# Altium schematic sheet mode.SchDoc
size A3
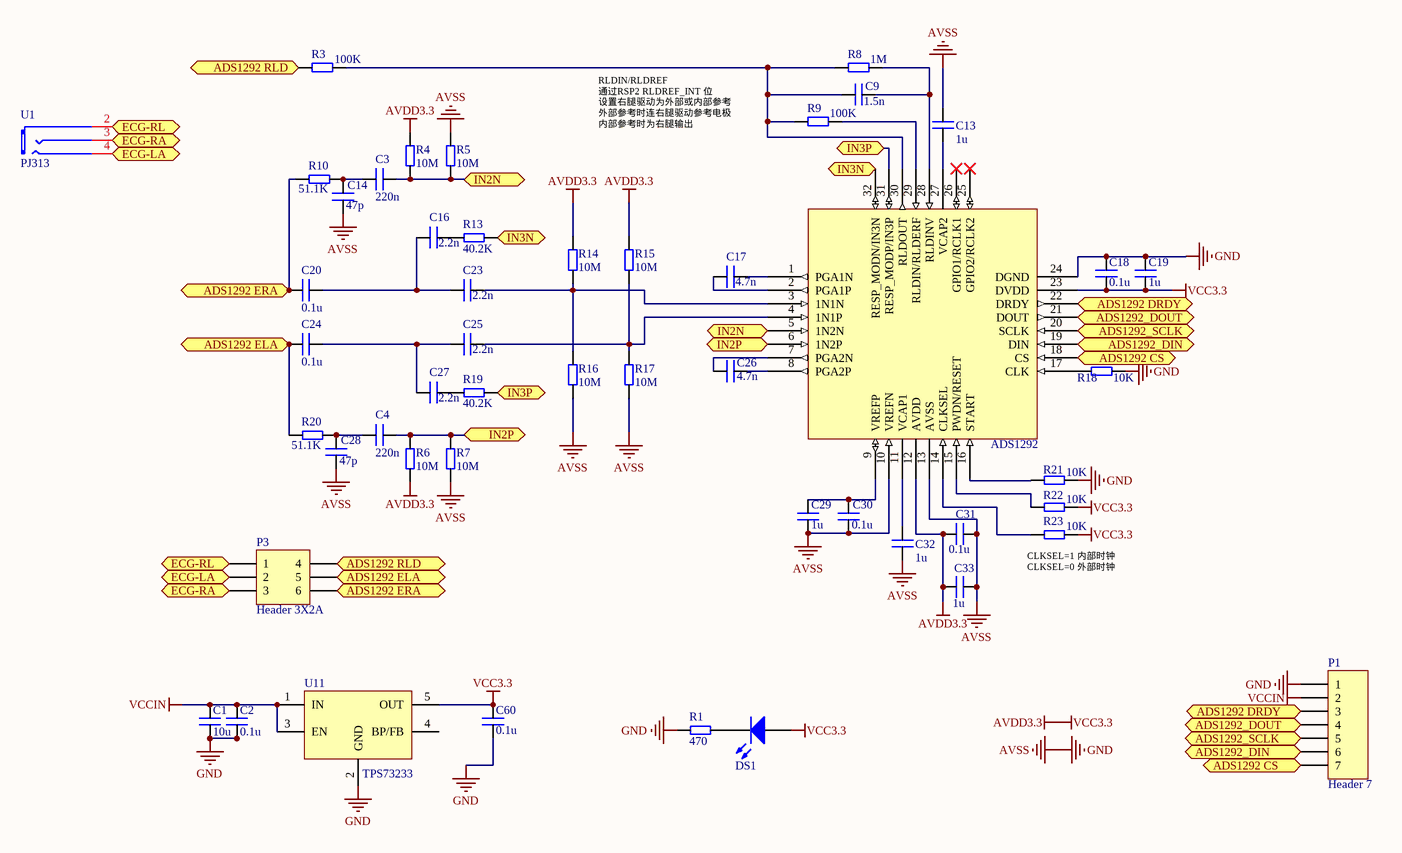
[diagram p0: mode.SchDoc]

## Parts
ADS1  ADS1292  [S-PQFP-G32]
C1  10u  [0603p]
C2  0.1u  [0603p]
C3  220n  [0603p]
C4  220n  [0603p]
C9  1.5n  [0603p]
C13  1u  [0603p]
C14  47p  [0603p]
C16  2.2n  [0603p]
C17  4.7n  [0603p]
C18  0.1u  [0603p]
C19  1u  [0603p]
C20  0.1u  [0603p]
C23  2.2n  [0603p]
C24  0.1u  [0603p]
C25  2.2n  [0603p]
C26  4.7n  [0603p]
C27  2.2n  [0603p]
C28  47p  [0603p]
C29  1u  [0603p]
C30  0.1u  [0603p]
C31  0.1u  [0603p]
C32  1u  [0603p]
C33  1u  [0603p]
C60  0.1u  [0603p]
DS1  LED  [SDMLED-0603]  (value not drawn)
P1  Header 7  [HDR1X7]
P3  Header 3X2A  [HDR2X3_CEN]
R1  470  [0603p]
R3  100K  [0603p]
R4  10M  [0603p]
R5  10M  [0603p]
R6  10M  [0603p]
R7  10M  [0603p]
R8  1M  [0603p]
R9  100K  [0603p]
R10  51.1K  [0603p]
R13  40.2K  [0603p]
R14  10M  [0603p]
R15  10M  [0603p]
R16  10M  [0603p]
R17  10M  [0603p]
R18  10K  [0603p]
R19  40.2K  [0603p]
R20  51.1K  [0603p]
R21  10K  [0603p]
R22  10K  [0603p]
R23  10K  [0603p]
U1  PJ313  [PJ313]
U11  TPS73233  [SOT25]

## Ports
ADS1292 CS, ADS1292 DRDY, ADS1292 ELA, ADS1292 ERA, ADS1292 RLD, ADS1292_DIN, ADS1292_DOUT, ADS1292_SCLK, ECG-LA, ECG-RA, ECG-RL, IN2N, IN2P, IN3N, IN3P

## Nets
AVDD3.3: ADS1.12(AVDD) ADS1.23(DVDD) C18.2 C19.2 C31.1 C33.1 C60.2 DS1.1(A) R4.1 R6.1 R14.2 R15.2 R22.2 R23.2 U11.5(OUT)  [also labelled VCC3.3]
AVSS: ADS1.10(VREFN) ADS1.13(AVSS) ADS1.24(DGND) C1.1 C2.1 C13.2 C14.1 C18.1 C19.1 C28.1 C29.1 C30.1 C31.2 C32.1 C33.2 C60.1 P1.1 R1.2 R5.1 R7.1 R16.1 R17.1 R18.2 R21.2 U11.2(GND)  [also labelled GND]
VCCIN: C1.2 C2.2 P1.2 U11.1(IN) U11.3(EN)
ADS1292 CS: ADS1.18(CS) P1.7 ; port ADS1292 CS
ADS1292 DRDY: ADS1.22(DRDY) P1.3 ; port ADS1292 DRDY
ADS1292 ELA: C24.2 P3.5 R20.1 ; port ADS1292 ELA
ADS1292 ERA: C20.2 P3.6 R10.1 ; port ADS1292 ERA
ADS1292 RLD: P3.4 R3.1 ; port ADS1292 RLD
ADS1292_DIN: ADS1.19(DIN) P1.6 ; port ADS1292_DIN
ADS1292_DOUT: ADS1.21(DOUT) P1.4 ; port ADS1292_DOUT
ADS1292_SCLK: ADS1.20(SCLK) P1.5 ; port ADS1292_SCLK
ECG-LA: P3.2 U1.4 ; port ECG-LA
ECG-RA: P3.3 U1.3 ; port ECG-RA
ECG-RL: P3.1 U1.2 ; port ECG-RL
IN2N: ADS1.5(1N2N) C3.1 R4.2 R5.2 ; port IN2N
IN2P: ADS1.6(1N2P) C4.1 R6.2 R7.2 ; port IN2P
IN3N: ADS1.32(RESP_MODN/IN3N) R13.2 ; port IN3N
IN3P: ADS1.31(RESP_MODP/IN3P) R19.2 ; port IN3P
NetADS1_1: ADS1.1(PGA1N) C17.1
NetADS1_2: ADS1.2(PGA1P) C17.2
NetADS1_3: ADS1.3(1N1N) C23.1 R14.1 R16.2
NetADS1_4: ADS1.4(1N1P) C25.1 R15.1 R17.2
NetADS1_7: ADS1.7(PGA2N) C26.2
NetADS1_8: ADS1.8(PGA2P) C26.1
NetADS1_9: ADS1.9(VREFP) C29.2 C30.2
NetADS1_11: ADS1.11(VCAP1) C32.2
NetADS1_14: ADS1.14(CLKSEL) R23.1
NetADS1_15: ADS1.15(PWDN/RESET) R22.1
NetADS1_16: ADS1.16(START) R21.1
NetADS1_17: ADS1.17(CLK) R18.1
NetADS1_27: ADS1.27(VCAP2) C13.1
NetADS1_28: ADS1.28(RLDINV) C9.1 R8.2
NetADS1_29: ADS1.29(RLDIN/RLDERF) R9.2
NetADS1_30: ADS1.30(RLDOUT) C9.2 R3.2 R8.1 R9.1
NetC3_2: C3.2 C14.2 R10.2
NetC4_2: C4.2 C28.2 R20.2
NetC16_1: C16.1 R13.1
NetC16_2: C16.2 C20.1 C23.2
NetC24_1: C24.1 C25.2 C27.2
NetC27_1: C27.1 R19.1
NetDS1_2: DS1.2(K) R1.1

Not connected (* = marked no-connect by the designer): ADS1 25(GPIO2/RCLK2)* 26(GPIO1/RCLK1)*; U11 4(BP/FB)

## Notes on the sheet
- (near R9) RLDIN/RLDREF
  通过RSP2 RLDREF_INT 位
  设置右腿驱动为外部或内部参考
  外部参考时连右腿驱动参考电极
  内部参考时为右腿输出
- (near R23) CLKSEL=1 内部时钟
  CLKSEL=0 外部时钟

## Library data of the parts
C1-C4 C9 C13 C14 C16-C20 C23-C33 C60 = C: 电容
P1 = Header 7: Header, 7-Pin; LatestRevisionDate: 17-Jul-2002; LatestRevisionNote: Re-released for DXP Platform.; Publisher: Altium Limited
P3 = Header 3X2A: Header, 3-Pin, Dual row; LatestRevisionDate: 17-Jul-2002; LatestRevisionNote: Re-released for DXP Platform.; Publisher: Altium Limited
R1 R3-R10 R13-R23 = R: 电阻
U1 = PHONE-PJ313: 3段耳机座
U11 = LDO-SOT23-5: TPS73201 5V升压
DS1 = LED: Published: 8-Jun-2000; LatestRevisionDate: 17-Jul-2002; LatestRevisionNote: Re-released for DXP Platform.; PackageDocument: Feb-2002; PackageReference: 3.2X1.6X1.1; Publisher: Altium Limited